# Altium schematic sheet ffb_wheel.SchDoc
size 474 x 379 mm; SheetNumber: 1; SheetTotal: 1
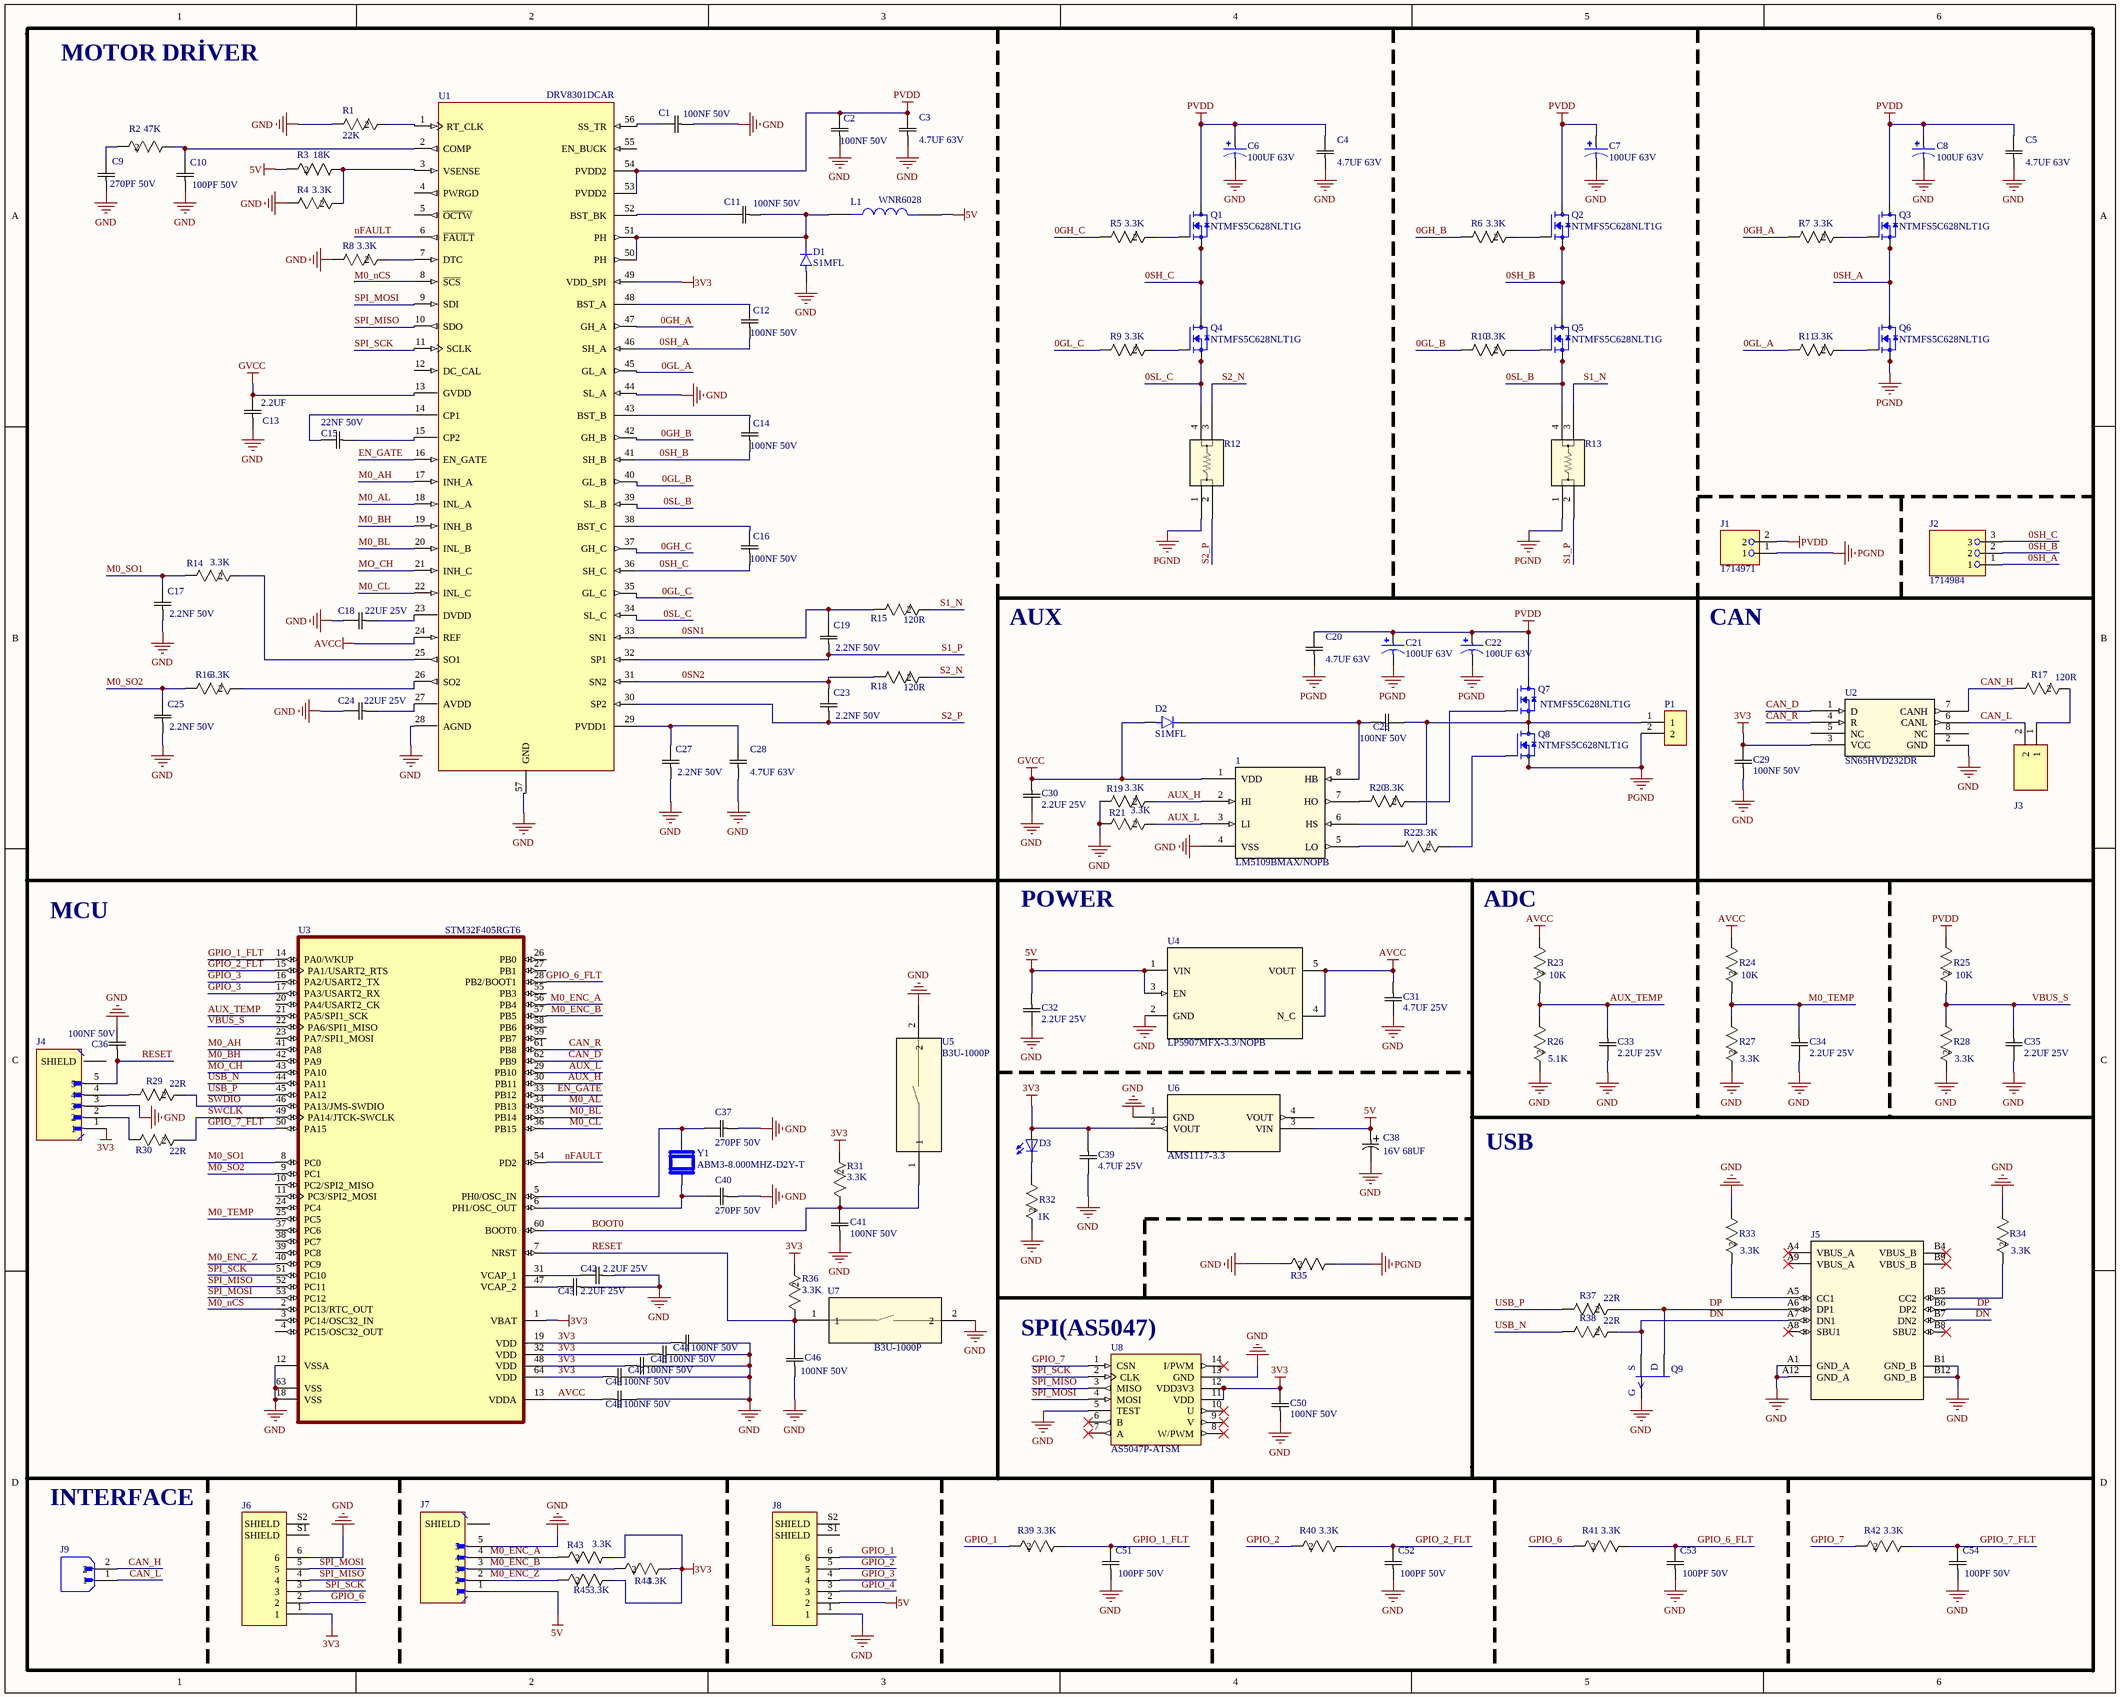
[diagram p0: ffb_wheel.SchDoc]

## Parts
1  LM5109BMAX/NOPB  [M08A]
C1  100NF 50V  [CAP_0402_TDK]
C2  100NF 50V  [0603_AVX]
C3  4.7UF 63V  [CAP_1206_B_WAL]
C4  4.7UF 63V  [CAP_1206_B_WAL]
C5  4.7UF 63V  [CAP_1206_B_WAL]
C6  100UF 63V  [CAP_EEEFT1C102GP]
C7  100UF 63V  [CAP_EEEFT1C102GP]
C8  100UF 63V  [CAP_EEEFT1C102GP]
C9  270PF 50V  [CAP_0402_TDK]
C10  100PF 50V  [CAP_0402_TDK]
C11  100NF 50V  [0603_AVX]
C12  100NF 50V  [0603_AVX]
C13  2.2UF  [0805_AVX]
C14  100NF 50V  [0603_AVX]
C15  22NF 50V  [CAP_0402_TDK]
C16  100NF 50V  [0603_AVX]
C17  2.2NF 50V  [CAP_0402_TDK]
C18  22UF 25V  [0805_AVX]
C19  2.2NF 50V  [CAP_0402_TDK]
C20  4.7UF 63V  [CAP_1206_B_WAL]
C21  100UF 63V  [CAP_EEEFT1C102GP]
C22  100UF 63V  [CAP_EEEFT1C102GP]
C23  2.2NF 50V  [CAP_0402_TDK]
C24  22UF 25V  [0805_AVX]
C25  2.2NF 50V  [CAP_0402_TDK]
C26  100NF 50V  [0603_AVX]
C27  2.2NF 50V  [CAP_0402_TDK]
C28  4.7UF 63V  [CAP_1206_B_WAL]
C29  100NF 50V  [0603_AVX]
C30  2.2UF 25V  [0805_AVX]
C31  4.7UF 25V  [0805_AVX]
C32  2.2UF 25V  [0805_AVX]
C33  2.2UF 25V  [0805_AVX]
C34  2.2UF 25V  [0805_AVX]
C35  2.2UF 25V  [0805_AVX]
C36  100NF 50V  [0603_AVX]
C37  270PF 50V  [CAP_0402_TDK]
C38  16V 68UF  [TAJB_AVX]
C39  4.7UF 25V  [0805_AVX]
C40  270PF 50V  [CAP_0402_TDK]
C41  100NF 50V  [0603_AVX]
C42  2.2UF 25V  [0805_AVX]
C43  2.2UF 25V  [0805_AVX]
C44  100NF 50V  [0603_AVX]
C45  100NF 50V  [0603_AVX]
C46  100NF 50V  [0603_AVX]
C47  100NF 50V  [0603_AVX]
C48  100NF 50V  [0603_AVX]
C49  100NF 50V  [0603_AVX]
C50  100NF 50V  [0603_AVX]
C51  100PF 50V  [CAP_0402_TDK]
C52  100PF 50V  [CAP_0402_TDK]
C53  100PF 50V  [CAP_0402_TDK]
C54  100PF 50V  [CAP_0402_TDK]
D1  S1MFL  [SODFL3617X108N]
D2  S1MFL  [SODFL3617X108N]
D3  LTST-C170TBKT  [DIOC200X125X110]  (value not drawn)
J1  1714971  [PHOENIX_1714971]
J2  1714984  [PHOENIX_1714984]
J3  3-644456-2  [TE_3-644456-2]  (value not drawn)
J4  BM05B-GHS-TBT(LF)(SN)(N)  [JST_BM05B-GHS-TBT(LF)(SN)(N)]  (value not drawn)
J5  USB4145-03-0230-C  [CONN_USB4145-03-0230-C_GCT]  (value not drawn)
J6  BM06B-GHS-TBT(LF)(SN)(N)  [JST_BM06B-GHS-TBT(LF)(SN)(N)]  (value not drawn)
J7  BM05B-GHS-TBT(LF)(SN)(N)  [JST_BM05B-GHS-TBT(LF)(SN)(N)]  (value not drawn)
J8  BM06B-GHS-TBT(LF)(SN)(N)  [JST_BM06B-GHS-TBT(LF)(SN)(N)]  (value not drawn)
J9  BM02B-GHS-TBT(LF)(SN)  [JST_BM02B-GHS-TBT(LF)(SN)]  (value not drawn)
L1  WNR6028  [IND_NR6028T4R7M]
P1  282837-2  [TE_282837-2]  (value not drawn)
Q1  NTMFS5C628NLT1G  [TRANS_NTMFS5C628NLT1G]
Q2  NTMFS5C628NLT1G  [TRANS_NTMFS5C628NLT1G]
Q3  NTMFS5C628NLT1G  [TRANS_NTMFS5C628NLT1G]
Q4  NTMFS5C628NLT1G  [TRANS_NTMFS5C628NLT1G]
Q5  NTMFS5C628NLT1G  [TRANS_NTMFS5C628NLT1G]
Q6  NTMFS5C628NLT1G  [TRANS_NTMFS5C628NLT1G]
Q7  NTMFS5C628NLT1G  [TRANS_NTMFS5C628NLT1G]
Q8  NTMFS5C628NLT1G  [TRANS_NTMFS5C628NLT1G]
Q9  SST176-SOT-23_3L  [SOT96P237X122-3N]  (value not drawn)
R1  22K  [RC0603N_PAN]
R2  47K  [RC0603N_PAN]
R3  18K  [RC0603N_PAN]
R4  3.3K  [RC0603N_PAN]
R5  3.3K  [RC0603N_PAN]
R6  3.3K  [RC0603N_PAN]
R7  3.3K  [RC0603N_PAN]
R8  3.3K  [RC0603N_PAN]
R9  3.3K  [RC0603N_PAN]
R10  3.3K  [RC0603N_PAN]
R11  3.3K  [RC0603N_PAN]
R12  WSK2512R0100DEA  [WSK2512_0.005-0.2_VIS]  (value not drawn)
R13  WSK2512R0100DEA  [WSK2512_0.005-0.2_VIS]  (value not drawn)
R14  3.3K  [RC0603N_PAN]
R15  120R  [RC0603N_PAN]
R16  3.3K  [RC0603N_PAN]
R17  120R  [RC0603N_PAN]
R18  120R  [RC0603N_PAN]
R19  3.3K  [RC0603N_PAN]
R20  3.3K  [RC0603N_PAN]
R21  3.3K  [RC0603N_PAN]
R22  3.3K  [RC0603N_PAN]
R23  10K  [RC0402N_PAN]
R24  10K  [RC0402N_PAN]
R25  10K  [RC0402N_PAN]
R26  5.1K  [RC0402N_PAN]
R27  3.3K  [RC0402N_PAN]
R28  3.3K  [RC0402N_PAN]
R29  22R  [RC0603N_PAN]
R30  22R  [RC0603N_PAN]
R31  3.3K  [RC0603N_PAN]
R32  1K  [RC0402N_PAN]
R33  3.3K  [RC0402N_PAN]
R34  3.3K  [RC0402N_PAN]
R35  ERJ-2GEJ433X  [RC0402N_PAN]  (value not drawn)
R36  3.3K  [RC0603N_PAN]
R37  22R  [RC0603N_PAN]
R38  22R  [RC0603N_PAN]
R39  3.3K  [RC0603N_PAN]
R40  3.3K  [RC0603N_PAN]
R41  3.3K  [RC0603N_PAN]
R42  3.3K  [RC0603N_PAN]
R43  3.3K  [RC0603N_PAN]
R44  3.3K  [RC0603N_PAN]
R45  3.3K  [RC0603N_PAN]
U1  DRV8301DCAR  [SOP50P810X120-57N]
U2  SN65HVD232DR  [D8]
U3  STM32F405RGT6  [QFP50P1200X1200X160-64N]
U4  LP5907MFX-3.3/NOPB  [DBV0005A_L]
U5  B3U-1000P  [B3U-1000P]
U6  AMS1117-3.3  [SOT-223_UMW]
U7  B3U-1000P  [B3U-1000P]
U8  AS5047P-ATSM  [SOP65P640X120-14N]
Y1  ABM3-8.000MHZ-D2Y-T  [XTAL_ABM3-8.000MHZ-D2Y-T]

## Nets
3V3: C29.2 C39.1 C44.1 C45.1 C47.1 C48.1 C50.2 D3.POS J4.1 J6.1 R31.2 R36.2 R43.1 R44.1 R45.1 U1.49(VDD_SPI) U2.3(VCC) U3.1(VBAT) U3.19(VDD) U3.32(VDD) U3.48(VDD) U3.64(VDD) U6.2(VOUT) U8.11(VDD) U8.12(VDD3V3)
5V: C32.1 C38.1 J7.1 J8.2 L1.2 R3.2 U4.1(VIN) U4.3(EN) U6.3(VIN)
AVCC: C31.1 C49.1 R23.1 R24.1 U1.24(REF) U3.13(VDDA) U4.4(N_C) U4.5(VOUT)
GND: 1.4(VSS) C1.1 C2.1 C3.1 C4.1 C5.1 C6.2 C7.2 C8.2 C9.1 C10.1 C13.1 C17.1 C18.2 C24.2 C25.1 C27.1 C28.1 C29.1 C30.2 C31.2 C32.2 C33.2 C34.2 C35.2 C36.2 C37.1 C38.2 C39.2 C40.1 C41.1 C42.1 C43.1 C44.2 C45.2 C46.1 C47.2 C48.2 C49.2 C50.1 C51.1 C52.1 C53.1 C54.1 D1.A J4.3 J5.A1(GND_A) J5.A12(GND_A) J5.B1(GND_B) J5.B12(GND_B) J6.6 J7.5 J8.1 Q9.3(G) R1.1 R4.1 R8.1 R19.1 R21.1 R26.2 R27.2 R28.2 R32.2 R33.1 R34.1 R35.2 U1.28(AGND) U1.44(SL_A) U1.57(GND) U2.2(GND) U3.12(VSSA) U3.18(VSS) U3.63(VSS) U4.2(GND) U5.2 U6.1(GND) U7.2 U8.5(TEST) U8.13(GND)
GVCC: 1.1(VDD) C13.2 C30.1 D2.A U1.13(GVDD)
PGND: C20.1 C21.2 C22.2 J1.1 P1.2 Q6.1(S) Q6.2(S) Q6.3(S) Q8.1(S) Q8.2(S) Q8.3(S) R12.1 R13.1 R35.1
PVDD: C2.2 C3.2 C4.2 C5.2 C6.1 C7.1 C8.1 C20.2 C21.1 C22.1 J1.2 Q1.5(D) Q2.5(D) Q3.5(D) Q7.5(D) R25.1 U1.53(PVDD2) U1.54(PVDD2)
0GH_A: R7.1 U1.47(GH_A)
0GH_B: R6.1 U1.42(GH_B)
0GH_C: R5.1 U1.37(GH_C)
0GL_A: R11.1 U1.45(GL_A)
0GL_B: R10.1 U1.40(GL_B)
0GL_C: R9.1 U1.35(GL_C)
0SH_A: C12.1 J2.1 Q3.1(S) Q3.2(S) Q3.3(S) Q6.5(D) U1.46(SH_A)
0SH_B: C14.1 J2.2 Q2.1(S) Q2.2(S) Q2.3(S) Q5.5(D) U1.41(SH_B)
0SH_C: C16.1 J2.3 Q1.1(S) Q1.2(S) Q1.3(S) Q4.5(D) U1.36(SH_C)
0SL_B: Q5.1(S) Q5.2(S) Q5.3(S) R13.4 U1.39(SL_B)
0SL_C: Q4.1(S) Q4.2(S) Q4.3(S) R12.4 U1.34(SL_C)
0SN1: C19.2 R15.1 U1.33(SN1)
0SN2: C23.2 R18.1 U1.31(SN2)
AUX_H: 1.2(HI) R19.2 U3.30(PB11)
AUX_L: 1.3(LI) R21.2 U3.29(PB10)
AUX_TEMP: C33.1 R23.2 R26.1 U3.21(PA5/SPI1_SCK)
BOOT0: C41.2 R31.1 U3.60(BOOT0) U5.1
CAN_D: U2.1(D) U3.62(PB9)
CAN_H: J9.2 R17.1 U2.7(CANH)
CAN_L: J3.2 J9.1 U2.6(CANL)
CAN_R: U2.4(R) U3.61(PB8)
DN: J5.A7(DN1) J5.B7(DN2) Q9.2(S) R38.2
DP: J5.A6(DP1) J5.B6(DP2) Q9.1(D) R37.2
EN_GATE: U1.16(EN_GATE) U3.33(PB12)
GPIO_1: J8.6 R39.2
GPIO_1_FLT: C51.2 R39.1 U3.14(PA0/WKUP)
GPIO_2: J8.5 R40.2
GPIO_2_FLT: C52.2 R40.1 U3.15(PA1/USART2_RTS)
GPIO_3: J8.4 U3.16(PA2/USART2_TX) U3.17(PA3/USART2_RX)
GPIO_4: J8.3
GPIO_6: J6.2 R41.2
GPIO_6_FLT: C53.2 R41.1 U3.28(PB2/BOOT1)
GPIO_7: R42.2 U8.1(CSN)
GPIO_7_FLT: C54.2 R42.1 U3.50(PA15)
M0_AH: U1.17(INH_A) U3.41(PA8)
M0_AL: U1.18(INL_A) U3.34(PB13)
M0_BH: U1.19(INH_B) U3.42(PA9)
M0_BL: U1.20(INL_B) U3.35(PB14)
M0_CL: U1.22(INL_C) U3.36(PB15)
M0_ENC_A: J7.4 R43.2 U3.56(PB4)
M0_ENC_B: J7.3 R44.2 U3.57(PB5)
M0_ENC_Z: J7.2 R45.2 U3.40(PC9)
M0_nCS: U1.8(~{SCS}) U3.2(PC13/RTC_OUT)
M0_SO1: C17.2 R14.1 U3.8(PC0)
M0_SO2: C25.2 R16.1 U3.9(PC1)
M0_TEMP: C34.1 R24.2 R27.1 U3.25(PC5)
MO_CH: U1.21(INH_C) U3.43(PA10)
nFAULT: U1.6(~{FAULT}) U3.54(PD2)
RESET: C36.1 C46.2 J4.5 R36.1 U3.7(NRST) U7.1
S1_N: R13.3 R15.2
S1_P: C19.1 R13.2 U1.32(SP1)
S2_N: R12.3 R18.2
S2_P: C23.1 R12.2 U1.30(SP2)
SPI_MISO: J6.4 U1.10(SDO) U3.52(PC11) U8.3(MISO)
SPI_MOSI: J6.5 U1.9(SDI) U3.53(PC12) U8.4(MOSI)
SPI_SCK: J6.3 U1.11(SCLK) U3.51(PC10) U8.2(CLK)
SWCLK: R30.2 U3.49(PA14/JTCK-SWCLK)
SWDIO: R29.2 U3.46(PA13/JMS-SWDIO)
USB_N: R38.1 U3.44(PA11)
USB_P: R37.1 U3.45(PA12)
VBUS_S: C35.1 R25.2 R28.1 U3.22(PA6/SPI1_MISO)
Net1_5: 1.5(LO) R22.1
Net1_6: 1.6(HS) C26.2 P1.1 Q7.1(S) Q7.2(S) Q7.3(S) Q8.5(D)
Net1_7: 1.7(HO) R20.1
Net1_8: 1.8(HB) C26.1 D2.C
NetC1_2: C1.2 U1.56(SS_TR)
NetC9_2: C9.2 R2.2
NetC10_2: C10.2 R2.1 U1.2(COMP)
NetC11_1: C11.1 D1.C L1.1 U1.50(PH) U1.51(PH)
NetC11_2: C11.2 U1.52(BST_BK)
NetC12_2: C12.2 U1.48(BST_A)
NetC14_2: C14.2 U1.43(BST_B)
NetC15_1: C15.1 U1.15(CP2)
NetC15_2: C15.2 U1.14(CP1)
NetC16_2: C16.2 U1.38(BST_C)
NetC18_1: C18.1 U1.23(DVDD)
NetC24_1: C24.1 U1.27(AVDD)
NetC27_2: C27.2 C28.2 U1.29(PVDD1)
NetC37_2: C37.2 U3.5(PH0/OSC_IN) Y1.2
NetC40_2: C40.2 U3.6(PH1/OSC_OUT) Y1.1
NetC42_2: C42.2 U3.31(VCAP_1)
NetC43_2: C43.2 U3.47(VCAP_2)
NetD3_NEG: D3.NEG R32.1
NetJ3_1: J3.1 R17.2
NetJ4_2: J4.2 R30.1
NetJ4_4: J4.4 R29.1
NetJ4_S1: J4.S1(SHIELD) J4.S2(SHIELD)
NetJ5_A5: J5.A5(CC1) R33.2
NetJ5_B5: J5.B5(CC2) R34.2
NetJ7_S1: J7.S1(SHIELD) J7.S2(SHIELD)
NetQ1_4: Q1.4(G) R5.2
NetQ2_4: Q2.4(G) R6.2
NetQ3_4: Q3.4(G) R7.2
NetQ4_4: Q4.4(G) R9.2
NetQ5_4: Q5.4(G) R10.2
NetQ6_4: Q6.4(G) R11.2
NetQ7_4: Q7.4(G) R20.2
NetQ8_4: Q8.4(G) R22.2
NetR1_2: R1.2 U1.1(RT_CLK)
NetR3_1: R3.1 R4.2 U1.3(VSENSE)
NetR8_2: R8.2 U1.7(DTC)
NetR14_2: R14.2 U1.25(SO1)
NetR16_2: R16.2 U1.26(SO2)

Not connected (* = marked no-connect by the designer): J5 A4(VBUS_A)* A8(SBU1)* A9(VBUS_A)* B4(VBUS_B)* B8(SBU2)* B9(VBUS_B)*; J6 S1(SHIELD) S2(SHIELD); J8 S1(SHIELD) S2(SHIELD); U1 4(PWRGD) 5(~{OCTW}) 12(DC_CAL) 55(EN_BUCK); U2 5(NC) 8(NC); U3 3(PC14/OSC32_IN) 4(PC15/OSC32_OUT) 10(PC2/SPI2_MISO) 11(PC3/SPI2_MOSI) 20(PA4/USART2_CK) 23(PA7/SPI1_MOSI) 24(PC4) 26(PB0) 27(PB1) 37(PC6) 38(PC7) 39(PC8) 55(PB3) 58(PB6) 59(PB7); U6 4(VOUT); U8 6(B)* 7(A)* 8(W/PWM)* 9(V)* 10(U)* 14(I/PWM)*

## Notes on the sheet
- MOTOR DRİVER
- AUX
- CAN
- MCU
- POWER
- ADC
- USB
- (near U8) SPI(AS5047)
- INTERFACE

## Library data of the parts
1 = LM5109BMAXNOPB: 1-A, 100-V half bridge gate driver with 8-V UVLO and high noise immunity 8-SOIC -40 to 125; Manufacturer_Name: Texas Instruments; Copyright: Copyright (C) 2025 Ultra Librarian. All rights reserved.; Manufacturer_Part_Number: LM5109BMAX/NOPB; Datasheet: https://www.ti.com/lit/gpn/lm5109b; RefDes: RefDes; Type: Type
C1 C9 C10 C15 C17 C19 C23 C25 C27 C37 C40 C51-C54 = 0402: No Description Available; Manufacturer_Name: TDK; Manufacturer_Part_Number: C0402X5R0J103K020BC; Copyright: Copyright (C) 2025 Ultra Librarian. All rights reserved.
C2 C11 C12 C14 C16 C26 C29 C36 C41 C44-C50 = 0603: Description; Manufacturer_Name: KYOCERA AVX; Manufacturer_Part_Number: 0603YC683KAT2A; Copyright: Copyright (C) 2025 Ultra Librarian. All rights reserved.
C3-C5 C20 C28 = 1206: Description; Manufacturer_Name: Walsin; Manufacturer_Part_Number: 1206B104J500CT; Copyright: Copyright (C) 2025 Ultra Librarian. All rights reserved.
C6-C8 C21 C22 = EEEFT1C102GP: Cap Aluminum 1000uF 16V 20% (10 X 10.2mm) SMD Cylindrical 0.06 Ohm 1190mA 5000hr 105Â°C Emboss T/R; MF: Panasonic; Digi-Key_Part_Number: PCE5115TR-ND; Check_prices: https://www.snapeda.com/parts/EEEFT1C102GP/Panasonic/view-part/?ref=eda; SnapEDA_Link: https://www.snapeda.com/parts/EEEFT1C102GP/Panasonic/view-part/?ref=snap; Value: *; Purchase-URL: https://pricing.snapeda.com/search/part/EEEFT1C102GP/?ref=eda; Package: RADIAL-2 Panasonic; MP: EEEFT1C102GP
C13 C18 C24 C30-C35 C39 C42 C43 = 0805: Description; Manufacturer_Name: KYOCERA AVX; Manufacturer_Part_Number: 08051C473KAT2A; Copyright: Copyright (C) 2025 Ultra Librarian. All rights reserved.
C38 = (3.5 X 2.8 X 1.9mm): Cap Tant Solid 47uF 6.3V B CASE 10% (3.5 X 2.8 X 1.9mm); Manufacturer_Name: KYOCERA AVX; Manufacturer_Part_Number: TAJB476K006RNJ; Copyright: Copyright (C) 2025 Ultra Librarian. All rights reserved.
D1 D2 = S1MFL: Diode Standard 1000 V 1A Surface Mount SOD-123F; MF: ON Semiconductor; SnapEDA_Link: https://www.snapeda.com/parts/S1MFL/Onsemi/view-part/?ref=snap; Package: SOD-123F ON Semiconductor; Value: *; MP: S1MFL; Check_prices: https://www.snapeda.com/parts/S1MFL/Onsemi/view-part/?ref=eda
D3 = LTST-C170TBKT: Blue 470nm LED Indication - Discrete 3.3V 0805 (2012 Metric); MF: Lite-On Electronics; SnapEDA_Link: https://www.snapeda.com/parts/LTST-C170TBKT/Lite-On/view-part/?ref=snap; Package: 0805 Lite-On; Value: *; MP: LTST-C170TBKT; Check_prices: https://www.snapeda.com/parts/LTST-C170TBKT/Lite-On/view-part/?ref=eda
J2 = 1714984: PCB Terminal Screw 9.52mm 10AWG 1000V 32A 3 Position COMBICON MKDS Series | Phoenix Contact 1714984; SnapEDA_Link: https://www.snapeda.com/parts/1714984/Phoenix+Contact/view-part/?ref=snap; Package: None; Value: *; MF: Phoenix Contact; MP: 1714984; Check_prices: https://www.snapeda.com/parts/1714984/Phoenix+Contact/view-part/?ref=eda
J3 = 3-644456-2: HEADER ASSEMBLY, NARROW, MTA-100, 2 POSITION, STRAIGHT | TE Connectivity 3-644456-2; SnapEDA_Link: https://www.snapeda.com/parts/3-644456-2/TE+Connectivity+AMP+Connectors/view-part/?ref=snap; Package: None; Value: *; MF: TE Connectivity; MP: 3-644456-2; Check_prices: https://www.snapeda.com/parts/3-644456-2/TE+Connectivity+AMP+Connectors/view-part/?ref=eda
J4 J7 = BM05B-GHS-TBT(LF)(SN)(N): Connector Header Surface Mount 5 position 0.049 (1.25mm); MF: JST Sales; SnapEDA_Link: https://www.snapeda.com/parts/BM05B-GHS-TBT(LF)(SN)(N)/JST/view-part/?ref=snap; Package: None; Value: *; MP: BM05B-GHS-TBT(LF)(SN)(N); Check_prices: https://www.snapeda.com/parts/BM05B-GHS-TBT(LF)(SN)(N)/JST/view-part/?ref=eda
J5 = USB4145-03-0230-C: Description; Manufacturer_Name: Global Connector Technology; Copyright: Copyright (C) 2025 Ultra Librarian. All rights reserved.; Manufacturer_Part_Number: USB4145-03-0230-C; RefDes: RefDes; Type: Type
J6 J8 = BM06B-GHS-TBT(LF)(SN)(N): Connector Header Surface Mount 6 position 0.049 (1.25mm); MF: JST Sales; SnapEDA_Link: https://www.snapeda.com/parts/BM06B-GHS-TBT(LF)(SN)(N)/JST/view-part/?ref=snap; Package: None; Value: *; MP: BM06B-GHS-TBT(LF)(SN)(N); Check_prices: https://www.snapeda.com/parts/BM06B-GHS-TBT(LF)(SN)(N)/JST/view-part/?ref=eda
J9 = BM02B-GHS-TBT(LF)(SN): Connector Header Surface Mount 2 position 0.049 (1.25mm); MF: JST Sales; SnapEDA_Link: https://www.snapeda.com/parts/BM02B-GHS-TBT%20(LF)(SN)/JST/view-part/?ref=snap; Package: None; Value: *; MP: BM02B-GHS-TBT (LF)(SN); Check_prices: https://www.snapeda.com/parts/BM02B-GHS-TBT%20(LF)(SN)/JST/view-part/?ref=eda
L1 = NR6028T4R7M: 4.7 ÂµH Shielded Drum Core, Wirewound Inductor 3 A 40.3mOhm Max Nonstandard; MF: Taiyo Yuden; SnapEDA_Link: https://www.snapeda.com/parts/NR6028T4R7M/Taiyo+Yuden/view-part/?ref=snap; Package: Nonstandard Taiyo Yuden; Value: *; MP: NR6028T4R7M; Check_prices: https://www.snapeda.com/parts/NR6028T4R7M/Taiyo+Yuden/view-part/?ref=eda
P1 = 282837-2: Ð Ð°Ð·ÑŠÐµÐ¼Ð½Ñ‹Ðµ ÐºÐ»ÐµÐ¼Ð¼Ð½Ñ‹Ðµ ÐºÐ¾Ð»Ð¾Ð´ÐºÐ¸ Ð Ð¾Ð·ÐµÑ‚ÐºÐ° 2 Ð¿Ð¾Ð»Ð¾Ð¶ÐµÐ½Ð¸Ñ 5,08 Ð¼Ð¼ ÐŸÑ€Ð¸Ð¿Ð¾Ð¹ Ð¿Ñ€ÑÐ¼Ð¾Ð¹ Ñ‡ÐµÑ€ÐµÐ· Ð¾Ñ‚Ð²ÐµÑ€ÑÑ‚Ð¸Ðµ 13,5 Ð / ÐºÐ¾Ð½Ñ‚Ð°ÐºÑ‚; MF: TE Connectivity; SnapEDA_Link: https://www.snapeda.com/parts/282837-2/TE+Connectivity+AMP+Connectors/view-part/?ref=snap; Price: None; Check_prices: https://www.snapeda.com/parts/282837-2/TE+Connectivity+AMP+Connectors/view-part/?ref=eda; Purchase-URL: https://pricing.snapeda.com/search/part/282837-2/?ref=eda; MP: 282837-2; Value: *; Availability: In Stock; Package: None
Q1-Q8 = NTMFS5C628NLT1G: N-Channel 60 V 28A (Ta), 150A (Tc) 3.7W (Ta), 110W (Tc) Surface Mount 5-DFN (5x6) (8-SOFL); MF: ON Semiconductor; SnapEDA_Link: https://www.snapeda.com/parts/NTMFS5C628NLT1G/Onsemi/view-part/?ref=snap; Package: SO-8 ON Semiconductor; Value: *; MP: NTMFS5C628NLT1G; Check_prices: https://www.snapeda.com/parts/NTMFS5C628NLT1G/Onsemi/view-part/?ref=eda
Q9 = SST176-SOT-23_3L: P-CHANNEL, SINGLE, JFET SWITCH; MF: Linear Systems; MP: SST176-SOT-23 3L; SnapEDA_Link: https://www.snapeda.com/parts/SST176-SOT-23%203L/Linear+Integrated+Systems/view-part/?ref=snap; Package: None; Value: *; Check_prices: https://www.snapeda.com/parts/SST176-SOT-23%203L/Linear+Integrated+Systems/view-part/?ref=eda
R1-R11 R14-R22 R29-R31 R36-R45 = 0603: No Description Available; Manufacturer_Name: Panasonic; Manufacturer_Part_Number: ERJ-3GEYJ6R8V; Copyright: Copyright (C) 2025 Ultra Librarian. All rights reserved.
R12 R13 = WSK2512R0100DEA: WSK-2512 .01 .5% EA e3; Manufacturer_Name: Vishay; Copyright: Copyright (C) 2025 Ultra Librarian. All rights reserved.; Manufacturer_Part_Number: WSK2512R0100DEA; Datasheet: https://www.vishay.com/doc?30108; RefDes: RefDes; Type: Type
R23-R28 R32-R34 = 0402: No Description Available; Manufacturer_Name: Panasonic; Manufacturer_Part_Number: ERJ-2GEJ433X; Copyright: Copyright (C) 2025 Ultra Librarian. All rights reserved.
R35 = 0402: No Description Available; Manufacturer_Name: Panasonic; Copyright: Copyright (C) 2025 Ultra Librarian. All rights reserved.; Manufacturer_Part_Number: ERJ-2GEJ433X
U1 = DRV8301DCAR: ç”µæœºé©±åŠ¨å™¨åŠŸçŽ‡MOSFET SPI 56-HTSSOP; MF: Texas Instruments; Package: HTSSOP-56 Texas Instruments; Value: *; Digi-Key_Purchase_URL: https://www.digikey.com.cn/product-detail/zh/texas-instruments/DRV8301DCAR/296-29433-1-ND/2743170?utm_source=snapeda&utm_medium=aggregator&utm_campaign=symbol; Digi-Key_Part_Number: 296-29433-1-ND; MP: DRV8301DCAR; SnapEDA_Link: https://www.snapeda.com/parts/DRV8301DCAR/Texas%20Instruments/view-part/46687/?ref=snap
U2 = SN65HVD232DR: 3.3 V CAN Transceiver 8-SOIC -40 to 85; Manufacturer_Name: Texas Instruments; Copyright: Copyright (C) 2025 Ultra Librarian. All rights reserved.; Manufacturer_Part_Number: SN65HVD232DR; RefDes: RefDes; Type: Type
U3 = STM32F405RGT6: ARMÂ® CortexÂ®-M4 STM32F4 Microcontroller IC 32-Bit Single-Core 168MHz 1MB (1M x 8) FLASH 64-LQFP (10x10); MF: STMicroelectronics; SnapEDA_Link: https://www.snapeda.com/parts/STM32F405RGT6/STMicroelectronics/view-part/?ref=snap; Package: LQFP-64 STMicroelectronics; Value: *; MP: STM32F405RGT6; Check_prices: https://www.snapeda.com/parts/STM32F405RGT6/STMicroelectronics/view-part/?ref=eda
U4 = LP5907MFX-3.3NOPB: 250-mA, low-noise, high-PSRR, ultra-low-dropout voltage regulator with low IQ and enable 5-SOT-23 -40 to 125; Manufacturer_Name: Texas Instruments; TYPE: TYPE; RefDes: RefDes; Copyright: Copyright (C) 2025 Ultra Librarian. All rights reserved.; Manufacturer_Part_Number: LP5907MFX-3.3/NOPB
U5 U7 = B3U-1000P: Description; Manufacturer_Name: Omron; Copyright: Copyright (C) 2025 Ultra Librarian. All rights reserved.; Manufacturer_Part_Number: B3U-1000P; RefDes: RefDes; Type: Type
U6 = AMS1117-3.3: Description; Manufacturer_Name: UMW(Youtai Semiconductor Co., Ltd.); Copyright: Copyright (C) 2025 Ultra Librarian. All rights reserved.; Manufacturer_Part_Number: AMS1117-3.3; RefDes: RefDes; Type: Type
U8 = AS5047P-ATSM: Rotary Encoder Magnetic Programmable PWM -; MF: ams; SnapEDA_Link: https://www.snapeda.com/parts/AS5047P-ATSM/ams/view-part/?ref=snap; Package: TSSOP-14 ams; Value: *; MP: AS5047P-ATSM; Check_prices: https://www.snapeda.com/parts/AS5047P-ATSM/ams/view-part/?ref=eda
Y1 = ABM3-8.000MHZ-D2Y-T: 8 MHz Â±20ppm Crystal 18pF 140 Ohms 2-SMD, No Lead; MF: Abracon; Purchase-URL: https://pricing.snapeda.com/search/part/ABM3-8.000MHZ-D2Y-T/?ref=eda; MP: ABM3-8.000MHZ-D2Y-T; SnapEDA_Link: https://www.snapeda.com/parts/ABM3-8.000MHZ-D2Y-T/Abracon+LLC/view-part/?ref=snap; Value: *; Package: SMD-2 Abracon; Price: None; Availability: In Stock; Check_prices: https://www.snapeda.com/parts/ABM3-8.000MHZ-D2Y-T/Abracon+LLC/view-part/?ref=eda
J1 = 1714971: Package: None; Price: None; Value: *; MP: 1714971; Availability: Unavailable